# EAGLE design untitled (EAGLE 9.6.2)
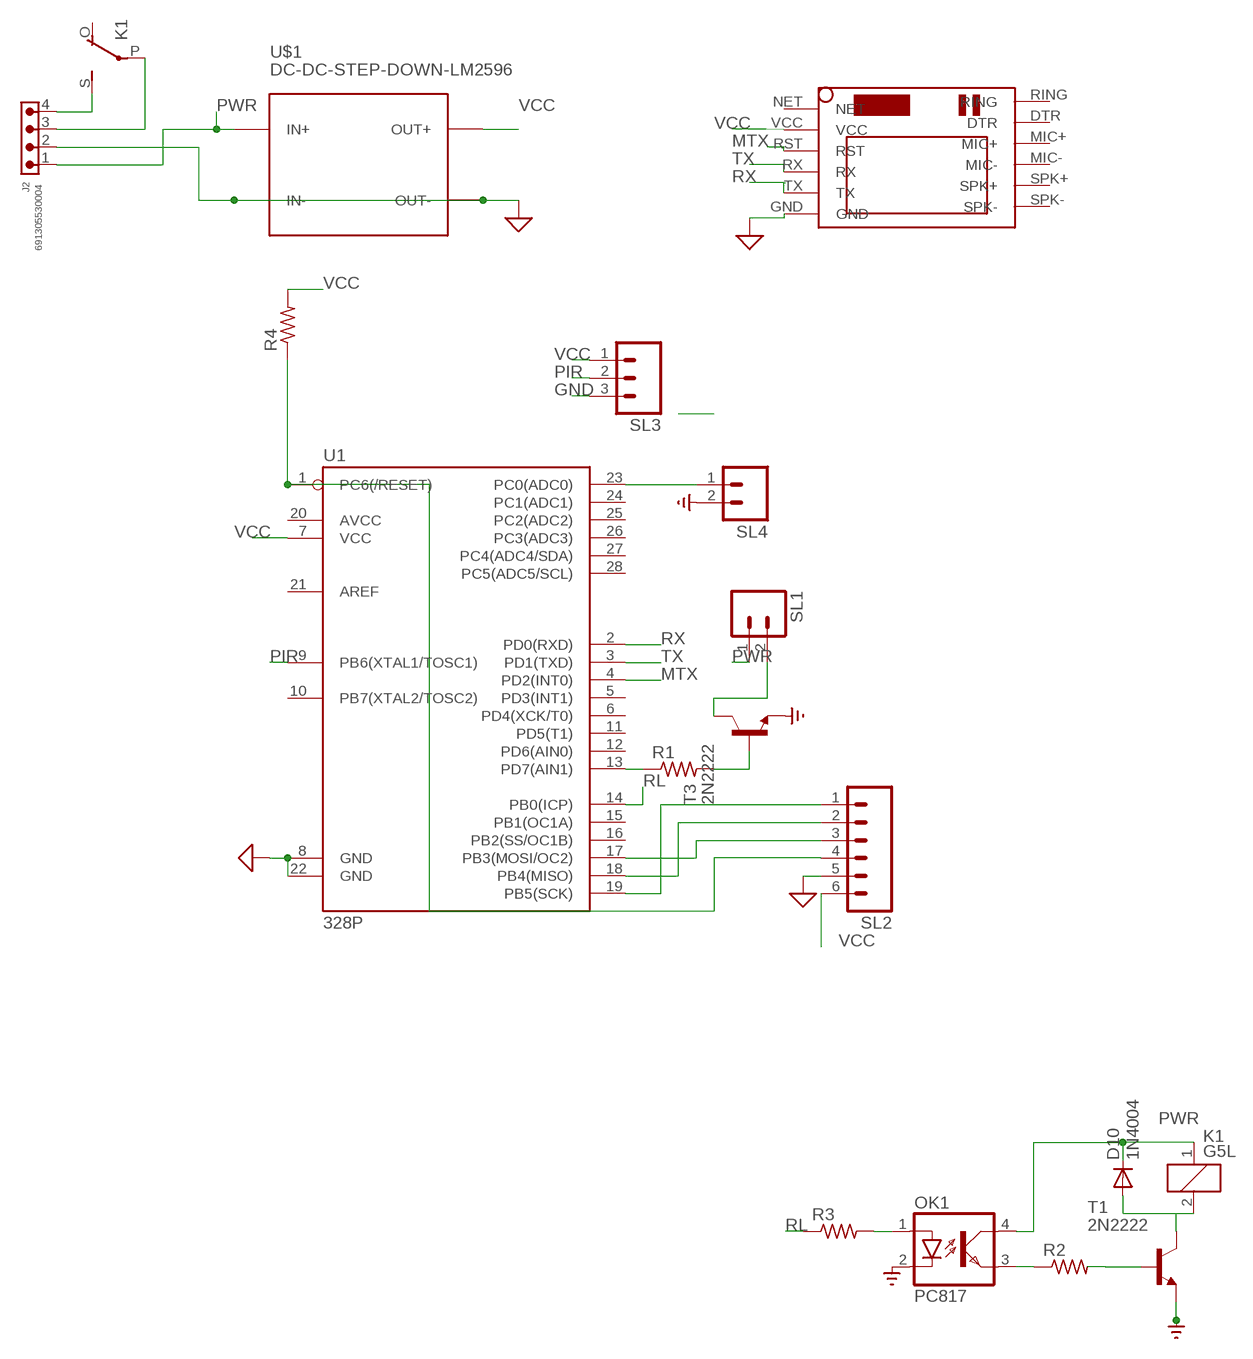
[diagram p0: schematic, sheet 1]

## Parts
D10  1N4004  [DO41-10]
J2  691305530004  691305530004  [691305530004]
K1  G5L  [G5LE]
OK1  PC817  [DIL04]
R1  R-US_0207/10  [0207/10]
R2  R-US_0207/10  [0207/10]
R3  R-US_0207/15  [0207/15]
R4  R-US_0207/15  [0207/15]
SL1  M02  [02P]
SL2  M06  [06P]
SL3  M03  [03P]
SL4  M02  [02P]
T1  2N2222  [TO92-EBC-OVAL]
T3  2N2222  [TO92-EBC-OVAL]
U1  328P  ATMEGA328P_PDIP  [DIP28]
U$1  DC-DC-STEP-DOWN-LM2596  [DC-DC-STEP-DOWN-LM2596]
U$2  SIM800LMODULE  [SIM800LMODULE]

## Nets
GND: J2.2 OK1.2(C) SL2.5 SL3.3 SL4.2 T1.E T3.E U1.8(GND) U1.22(GND) U$1.IN- U$1.OUT- U$2.GND ; supply symbol labelled SUP, SUPPLY_BRASTAN_GND_
MTX: U1.4(PD2(INT0)) U$2.RST
N$1: OK1.1(A) R3.2
N$2: SL1.2 T3.C
N$3: J2.4 K1.S(2:S)
N$4: SL2.1 U1.19(PB5(SCK))
N$5: SL2.2 U1.18(PB4(MISO))
N$6: SL2.3 U1.17(PB3(MOSI/OC2))
N$7: R1.1 U1.13(PD7(AIN1))
N$8: J2.3 K1.P(2:P)
N$9: D10.A K1.2 T1.C
N$10: R1.2 T3.B
N$11: SL4.1 U1.23(PC0(ADC0))
N$12: R2.2 T1.B
N$13: OK1.3(EMIT) R2.1
N$14: R4.1 SL2.4 U1.1(PC6(/RESET))
PIR: SL3.2 U1.9(PB6(XTAL1/TOSC1))
PWR: D10.C J2.1 K1.1 OK1.4(COL) SL1.1 U$1.IN+
RL: R3.1 U1.14(PB0(ICP))
RX: U1.2(PD0(RXD)) U$2.TX
TX: U1.3(PD1(TXD)) U$2.RX
VCC: R4.2 SL2.6 SL3.1 U1.7(VCC) U$1.OUT+ U$2.VCC
Unconnected: K1.O(2:O) U1.5(PD3(INT1)) U1.6(PD4(XCK/T0)) U1.10(PB7(XTAL2/TOSC2)) U1.11(PD5(T1)) U1.12(PD6(AIN0)) U1.15(PB1(OC1A)) U1.16(PB2(SS/OC1B)) U1.20(AVCC) U1.21(AREF) U1.24(PC1(ADC1)) U1.25(PC2(ADC2)) U1.26(PC3(ADC3)) U1.27(PC4(ADC4/SDA)) U1.28(PC5(ADC5/SCL)) U$2.DTR U$2.MIC+ U$2.MIC- U$2.NET U$2.RING U$2.SPK+ U$2.SPK-

## Library data of the parts
D10 = adafruit:1N4004: DIODE General purpose 1N400x type rectifier (With bigger pads) http://www.ladyada.net/library/pcb/eaglelibrary.html
J2 = Wurth_Connectors_WR-TBL Pluggable Connector:691305530004: WR-TBL Serie 3055 - 5,08 mm - PCB Header Vertical Entry with Plastic Latches KIND PROPERTIES Pitch 5.08 mm MATERIAL PROPERTIES Insulator Material PA66 Insulator Flammability Rating UL94 V-0 Insulator Color Green Terminal Material Copper Alloy Terminal Plating Tin-plated surface GENERAL INFORMATION Operating Temperature -40 up to +105 °C ELECTRICAL PROPERTIES IR UL 16 A Working Voltage [UL] 300 V (AC) Withstanding Voltage [UL] 2500 V (AC) Contact Resistance [UL] 20 mΩ CERTIFICATION UL Approval E315414 <https://www.we-online.com/catalog/media/o135349v209%20Family_WR-TBL3_6913055300xx.jpg> Details see: https://www.we-online.com/catalog/en/TBL_5_08_3055_6913055300XX/ Updated by Ella Wu 2019-12-30 2019(C) Wurth Elektronik; DATASHEET-URL: https://www.we-online.com/catalog/datasheet/691305530004.pdf; IR-UL: 16A; MOUNT: THT; PART-NUMBER: 691305530004; PINS: 4; PITCH: 5.08mm; TYPE: Vertical; WORKING-VOLTAGE-UL: 300V (AC)
K1 = relay:G5L: RELAY 1 x switch, 10 A/120 V AC, 8 A/30 V ADC, Omron; OC_FARNELL: unknown; OC_NEWARK: unknown
OK1 = optocoupler:PC817: SHARP OPTO COUPLER; MPN: PC817X4J000F; OC_FARNELL: 9707727; OC_NEWARK: 97K7059
R1 R2 R4 = BeagleBone_Black_Wireless:R-US_: RESISTOR, American symbol
R3 = adafruit:R-US_: RESISTOR, American symbol
SL1 SL4 = con-amp-quick:M02: AMP QUICK CONNECTOR; OC_FARNELL: unknown; OC_NEWARK: unknown
SL2 = con-amp-quick:M06: AMP QUICK CONNECTOR; OC_FARNELL: unknown; OC_NEWARK: unknown
SL3 = con-amp-quick:M03: AMP QUICK CONNECTOR; OC_FARNELL: unknown; OC_NEWARK: unknown
T1 T3 = adafruit:2N2222: NPN TRANSISTOR Big oval pads
U1 = SparkFun-IC-Microcontroller:ATMEGA328P_PDIP: Atmel 328P Through hole ATMEGA328P uC used in the Arduino 32kb flash, 1k EEPROM, 2k SRAM Datasheet <http://www.sparkfun.com/datasheets/Components/SMD/ATMega328.pdf> SparkFun Products Storefront component: AVR 28 Pin 20MHz 32K 6A/D - ATMega328P <https://www.sparkfun.com/products/9061> (COM-09061) SparkFun Simon Says - Through-Hole Soldering Kit <https://www.sparkfun.com/products/10547> (KIT-10547) SparkFun Learn to Solder - Simon Says <https://www.sparkfun.com/products/13708> (KIT-13708) SparkFun BigTime Watch Kit <https://www.sparkfun.com/products/11734> (KIT-11734) SparkFun ClockIt <https://www.sparkfun.com/products/10930> (KIT-10930) SparkFun Serial Enabled LCD Kit <https://www.sparkfun.com/products/10097> (LCD-10097) SparkFun Simon Tilts - Through Hole Soldering Kit <https://www.sparkfun.com/products/12634> (KIT-12634) SparkFun Frequency Counter Kit <https://www.sparkfun.com/products/10140> (KIT-10140) FabFM Radio Kit <https://www.sparkfun.com/products/11043> (KIT-11043) SparkFun Binary Blaster Kit <https://www.sparkfun.com/products/12037> (KIT-12037) SparkFun Metro-Gnome <https://www.sparkfun.com/products/9236> (KIT-09236) ATmega328 with Arduino Optiboot (Uno) <https://www.sparkfun.com/products/10524> (DEV-10524); PROD_ID: IC-09136
U$1 = diy-modules:DC-DC-STEP-DOWN-LM2596: DC/DC Step-Down Regulator based on LM2596-ADJ chip LM2596 datasheet available here: http://www.ti.com/lit/ds/symlink/lm2596.pdf Click here to find device on ebay.com <http://www.ebay.com/sch/lm2596+power+regulator>
U$2 = SIM800LMODULE:SIM800LMODULE: SIM800L Module

## Board
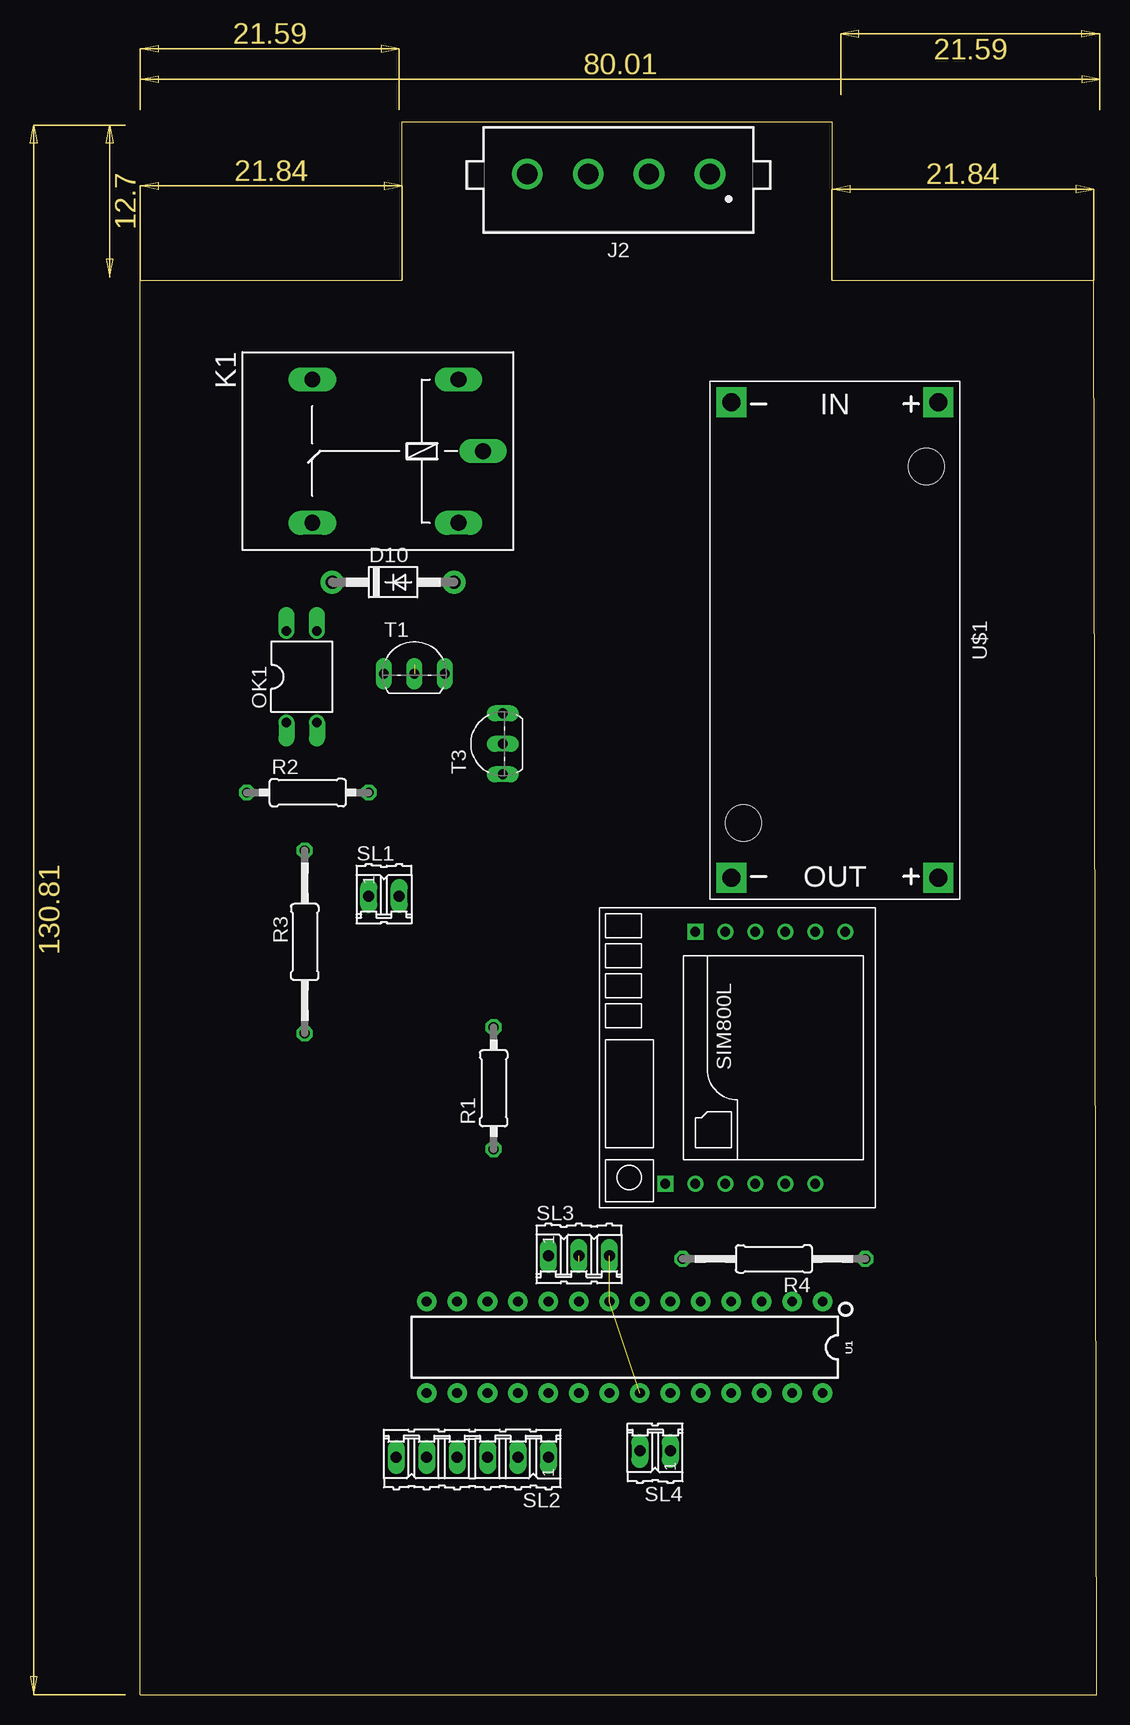
[diagram p1: board, top side]
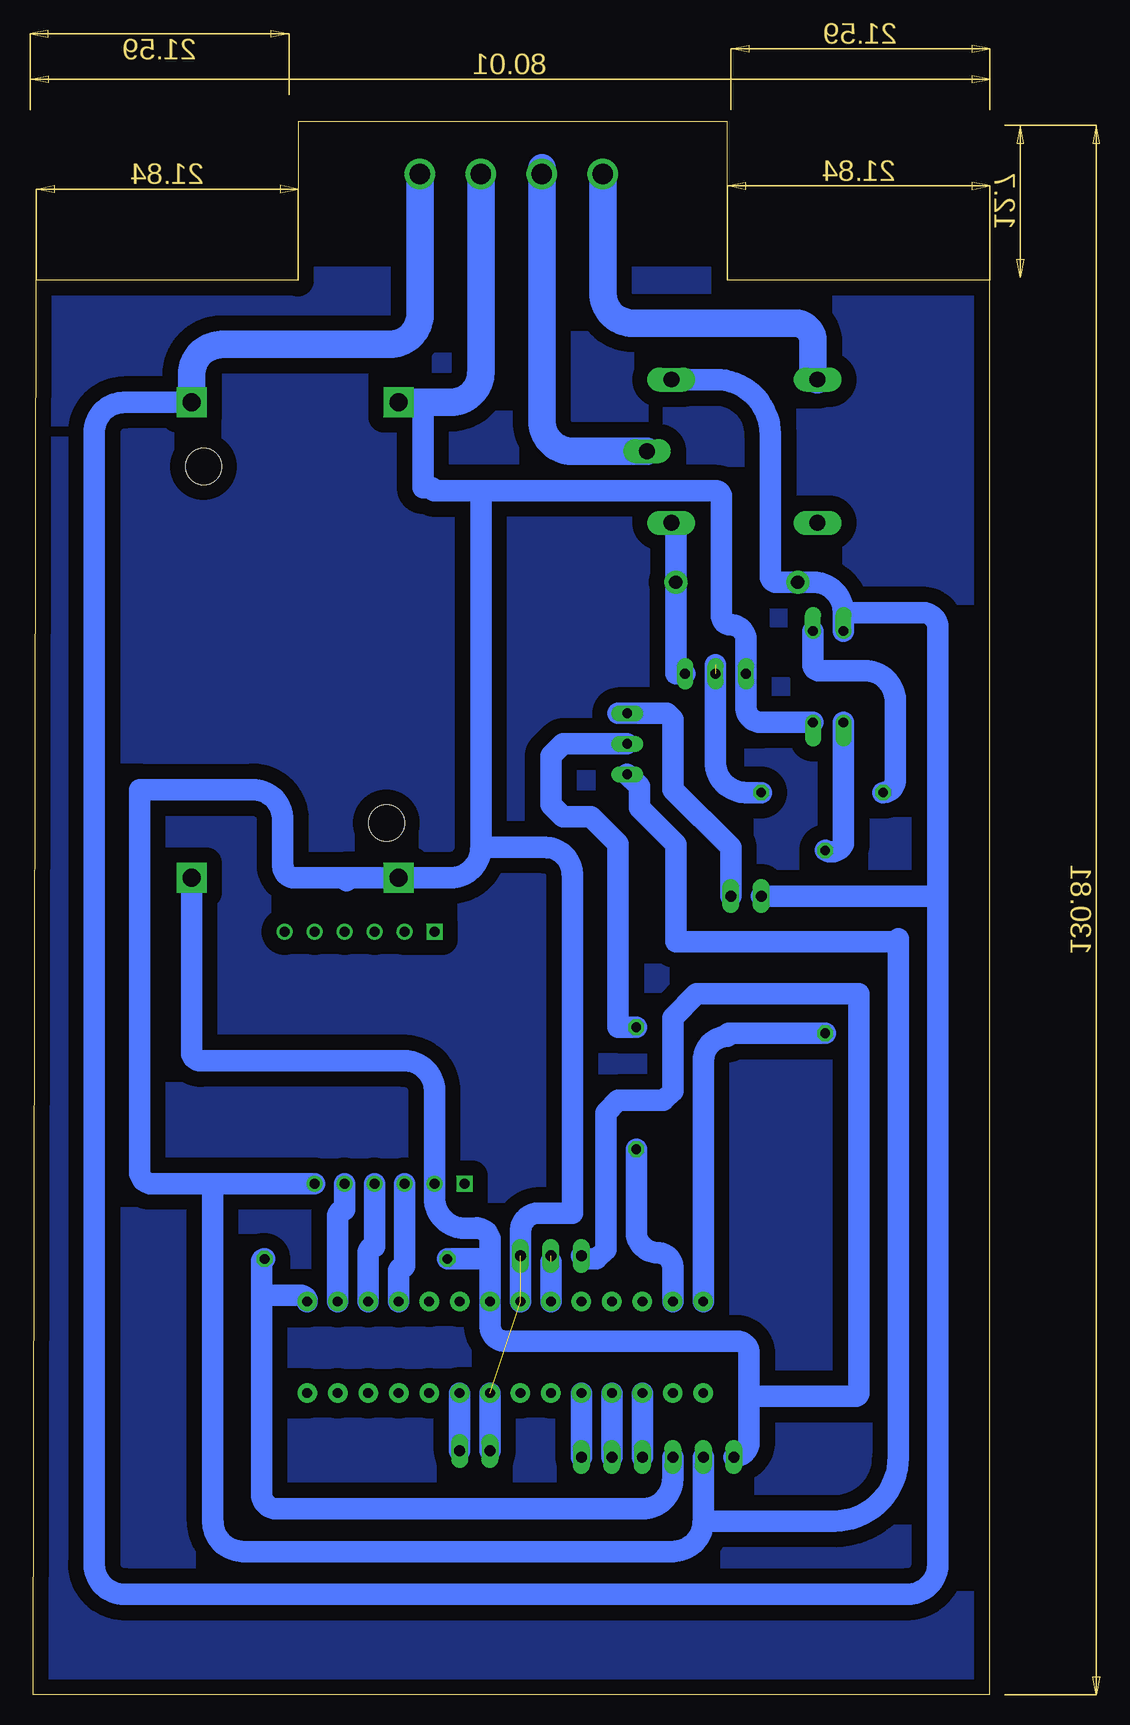
[diagram p2: board, bottom side, seen from below]

Size 79.76 x 131.06 mm. Coordinates in mm from the lower left corner, seen from the top.
Outline: 79.5,0 0,0 0,117.86 21.84,117.86 21.84,131.06 57.66,131.06 57.66,117.86 79.5,117.86 79.76,0 79.5,0
Outline: 79.5,0 79.68,0
Copper layers (1*16): Top 0.035mm / dielectric 1.5mm / Bottom 0.035mm
Design rules "default *": minimum track width 6mil, minimum drill 0.35mm, track to track 30mil, track to pad 30mil, pad to pad 30mil, via to via 30mil, smd to smd 6mil, copper to edge 40mil, drill to drill 6mil, minimum pad ring 10mil, minimum via ring 8mil, stop-mask expansion 4mil, vias tented up to drill 0mil, thermal gap 10mil

### Footprints (pad centres in the part's own frame; a part is rotated, then mirrored left to right if it is on the bottom)
DO41-10 = drill 1.118 pad 1.93: A 5.08,0; C -5.08,0
691305530004 = drill 1.7: 1 -7.62,0; 2 -2.54,0; 3 2.54,0; 4 7.62,0
G5LE = drill 1.321 long: 1 -7.493,-5.969; 2 -7.493,5.969; O 4.699,5.969; P -9.525,0; S 4.699,-5.969
DIL04 = drill 0.813 offset: 1 -1.27,-3.81; 2 1.27,-3.81; 3 1.27,3.81; 4 -1.27,3.81
0207/10 = drill 0.813 octagon: 1 -5.08,0; 2 5.08,0
0207/15 = drill 0.813 octagon: 1 -7.62,0; 2 7.62,0
02P = drill 0.914 long: 1 -1.27,0; 2 1.27,0
06P = drill 0.914 long: 1 -6.35,0; 2 -3.81,0; 3 -1.27,0; 4 1.27,0; 5 3.81,0; 6 6.35,0
03P = drill 0.914 long: 1 -2.54,0; 2 0,0; 3 2.54,0
TO92-EBC-OVAL = drill 0.813 long: B 0,-1.27; C 2.54,-1.27; E -2.54,-1.27
DIP28 = drill 0.813 pad 1.626: 1 -16.51,-3.81; 2 -13.97,-3.81; 3 -11.43,-3.81; 4 -8.89,-3.81; 5 -6.35,-3.81; 6 -3.81,-3.81; 7 -1.27,-3.81; 8 1.27,-3.81; 9 3.81,-3.81; 10 6.35,-3.81; 11 8.89,-3.81; 12 11.43,-3.81; 13 13.97,-3.81; 14 16.51,-3.81; 15 16.51,3.81; 16 13.97,3.81; 17 11.43,3.81; 18 8.89,3.81; 19 6.35,3.81; 20 3.81,3.81; 21 1.27,3.81; 22 -1.27,3.81; 23 -3.81,3.81; 24 -6.35,3.81; 25 -8.89,3.81; 26 -11.43,3.81; 27 -13.97,3.81; 28 -16.51,3.81
DC-DC-STEP-DOWN-LM2596 = drill 1.5 pad 2.5 square: IN+ -19.812,8.636; IN- -19.812,-8.636; OUT+ 19.812,8.636; OUT- 19.812,-8.636 | hole 3: -14.478,7.62; 15.24,-7.62
SIM800LMODULE = drill 0.8: DTR 10.5,1; GND -10.5,-6.5; MIC+ 10.5,-1.5; MIC- 10.5,-4; RST -10.5,1; RX -10.5,-1.5; SPK+ 10.5,-6.5; SPK- 10.5,-9; TX -10.5,-4; VCC -10.5,3.5 | drill 0.8 square: NET -10.5,6; RING 10.5,3.5

### Placement (x,y rotation side)
D10  21.08,92.71 0 top
J2  39.88,126.75 180 top
K1  19.05,103.63 180 top
OK1  13.46,84.84 0 top
R1  29.46,50.55 90 top
R2  13.97,75.18 0 top
R3  13.72,62.74 90 top
R4  52.83,36.32 180 top
SL1  20.32,66.55 0 top
SL2  27.69,19.81 180 top
SL3  36.58,36.58 0 top
SL4  42.93,20.32 180 top
T1  22.86,86.36 0 top
T3  28.96,79.25 90 top
U1  40.39,28.96 180 top
U$1  57.91,87.88 270 top
U$2  49.78,53.09 90 top

### Tracks (layer width: path | path; a pad name or v marks a point on that pad's centre or on a via)
GND  (2 unrouted)
  Bottom 1.778: OK1.2 19.05,81.03 arc90 20.32,82.3 T1.E 20.32,87.88 arc-90 21.59,89.15 arc90 22.35,89.92 22.35,99.82 arc-90 22.86,100.33 42.42,100.33 | 46.99,107.7 arc-90 47.24,107.44 47.24,100.58 46.48,100.58 arc-90 46.23,100.33 42.42,100.33 | 42.42,70.61 arc90 44.96,68.07 U$1.OUT- 53.85,68.07 | 42.42,70.61 42.42,100.33 | 53.85,68.07 57.91,68.07 arc90 58.93,69.09 58.93,72.9 arc-90 61.47,75.44 70.87,75.44 70.87,43.6 arc-90 69.85,42.59 64.77,42.59 | U1.8 39.12,38.61 arc90 37.59,40.13 34.8,40.13 34.8,68.33 arc-90 37.08,70.61 42.42,70.61 | 53.59,67.82 arc-90 53.85,68.07 | SL2.5 23.88,14.48 | 23.88,14.48 arc90 26.42,11.94 62.23,11.94 arc90 64.77,14.48 64.77,42.59 | U$2.GND 64.77,42.59 | 23.88,14.48 12.95,14.48 arc-90 7.62,19.81 7.62,62.99 7.87,62.74 26.16,62.74 26.16,70.87 29.21,73.91 29.21,75.69 T3.E | SL4.2 U1.22
  Bottom 2.286: J2.2 42.42,110.24 arc90 44.96,107.7 46.99,107.7 U$1.IN-
MTX
  Bottom 1.778: U$2.RST 48.78,35.8 arc90 49.02,35.56 arc-90 49.28,35.31 U1.4
N$1
  Bottom 1.778: OK1.1 12.19,70.87 arc90 R3.2
N$2
  Bottom 1.778: SL1.2 21.59,70.61 26.42,75.44 26.42,81.28 26.92,81.79 T3.C 30.99,81.79
N$3
  Bottom 2.286: 14.48,109.73 K1.S arc90 14.73,109.98 14.73,112.78 arc-90 16.26,114.3 29.72,114.3 arc90 32.26,116.84 J2.4
N$4
  Bottom 1.778: SL2.1 U1.19
N$5
  Bottom 1.778: SL2.2 U1.18
N$6
  Bottom 1.778: SL2.3 U1.17
N$7
  Bottom 1.778: U1.13 26.42,35.56 arc-90 27.69,36.83 arc90 29.46,38.61 R1.1
N$8
  Bottom 2.286: K1.P 34.8,103.63 arc90 37.34,106.17 J2.3 37.34,127.25
N$9
  Bottom 1.778: K1.2 26.16,97.66 D10.A 26.16,85.09 T1.C
N$10
  Bottom 1.778: R1.2 30.99,55.63 30.99,61.98 30.99,63.25 30.99,70.91 33.23,73.15 35.56,73.15 36.58,74.17 36.58,78.23 35.56,79.25 T3.B
N$11
  Bottom 1.778: SL4.1 U1.23
N$12  (1 unrouted)
  Bottom 1.778: R2.2 20.32,75.18 arc90 22.86,77.72 22.86,85.85
N$13
  Bottom 1.778: OK1.3 14.73,85.85 arc-90 14.22,85.34 10.41,85.34 arc90 7.87,82.8 7.87,76.2 arc90 R2.1
N$14
  Bottom 1.778: U1.1 arc-90 57.4,33.27 60.71,33.27 | 60.71,33.27 60.71,36.07 arc90 R4.1 | SL2.4 26.42,18.03 arc90 28.96,15.49 59.44,15.49 arc90 60.71,16.76 60.71,33.27
N$15
  pour Bottom (isolate 1.27): 0,0 79.5,0 79.76,0.25 79.76,117.6 79.25,118.11 57.91,118.11 0.25,118.11 0,117.86 0,0.25
PIR  (1 unrouted)
  Bottom 1.778: U1.9 36.58,36.07
PWR
  Bottom 1.778: K1.1 22.86,109.6 arc90 18.29,105.03 18.29,93.22 arc-90 17.78,92.71 D10.C 14.73,92.71 arc90 12.19,90.17 | OK1.4 12.19,90.17 | U$1.IN+ 72.14,107.7 arc-90 74.68,105.16 74.68,10.92 arc-90 72.14,8.38 6.86,8.38 arc-90 4.32,10.92 4.32,66.55 | 4.32,66.55 4.32,88.9 arc-90 5.59,90.17 12.19,90.17 | 4.32,66.55 SL1.1
  Bottom 2.286: U$1.IN+ 66.55,109.98 arc90 64.01,112.52 50.04,112.52 arc-90 47.5,115.06 J2.1
RL
  Bottom 1.778: U1.14 23.88,52.83 arc90 21.84,54.86 21.8,55.12 R3.1
RX
  Bottom 1.778: U$2.TX 53.78,40.45 arc90 53.85,40.39 arc-90 54.36,39.88 U1.2
TX
  Bottom 1.778: U$2.RX 51.28,37.36 arc90 51.31,37.34 arc-90 51.82,36.83 U1.3
VCC
  Bottom 1.778: U$1.OUT+ 66.55,53.59 arc-90 65.79,52.83 48.82,52.83 arc90 46.28,50.29 U$2.VCC 46.28,41.4 arc-90 43.74,38.86 42.67,38.86 | 42.67,38.86 arc90 41.66,37.85 41.66,36.32 | 42.67,38.86 arc90 42.73,38.92 | 41.66,36.32 U1.7 41.66,30.73 arc-90 40.39,29.46 21.08,29.46 arc90 20.07,28.45 20.07,24.89 | SL2.6 arc-90 20.07,21.08 20.07,24.89 | R4.2 41.66,36.32 | 20.07,24.89 11.18,24.89 arc-90 10.92,25.15 10.92,58.42 24.43,58.42 26.42,56.44 26.42,50.29 27.18,49.53 30.99,49.53 32,48.51 32,37.08 32.77,36.32 33.78,36.32 SL3.1